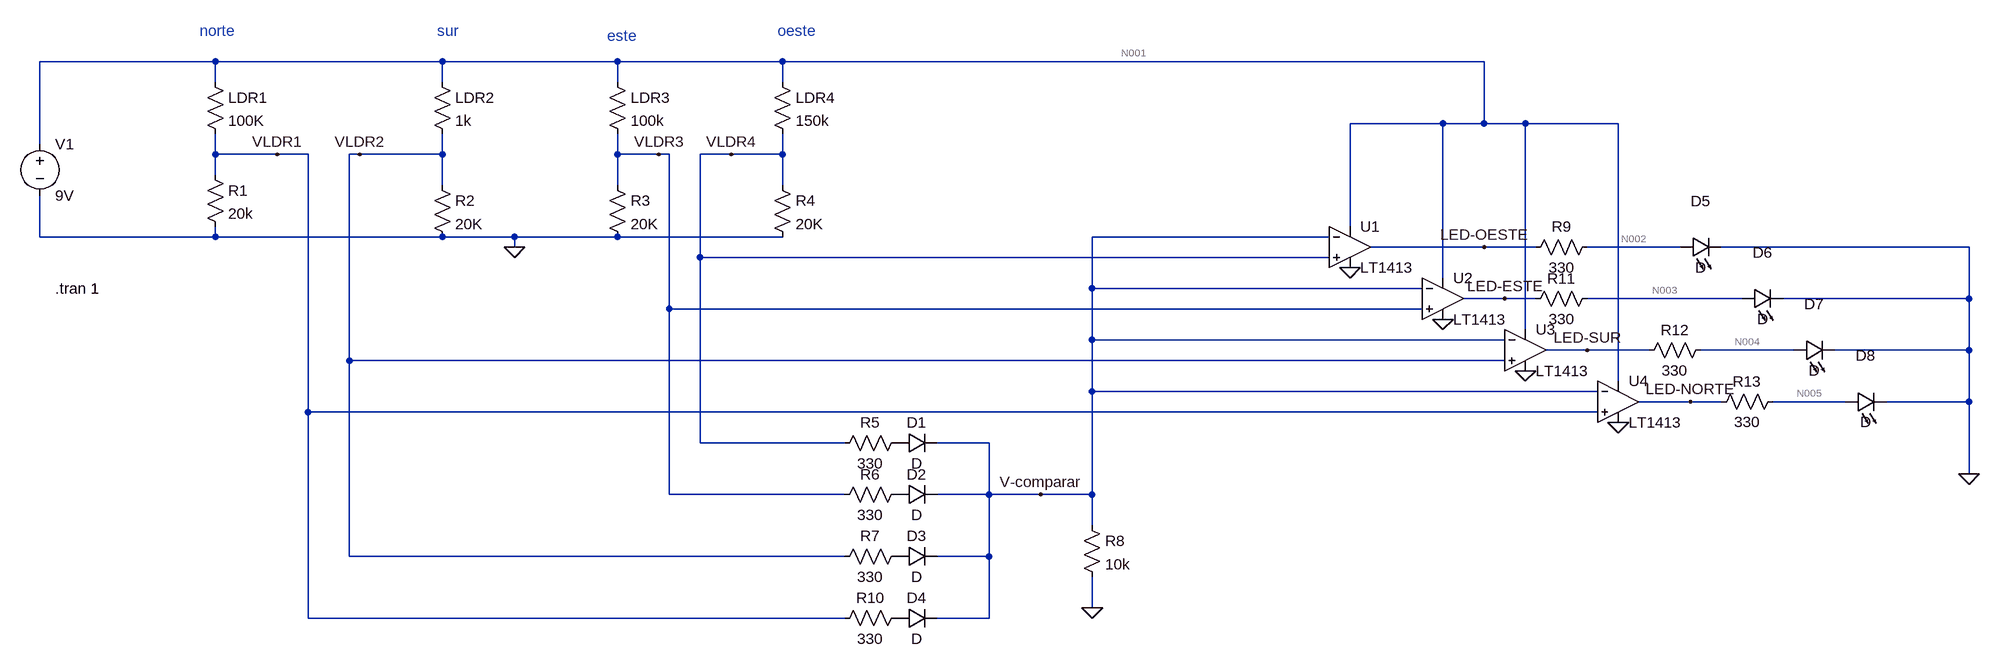
[diagram p0: schematic idea2_tp8.asc]
idea2_tp8.asc, the LTspice schematic file:
Version 4
SHEET 1 2996 704
WIRE 256 -592 -16 -592
WIRE 608 -592 256 -592
WIRE 880 -592 608 -592
WIRE 1136 -592 880 -592
WIRE 2224 -592 1136 -592
WIRE 256 -560 256 -592
WIRE 608 -560 608 -592
WIRE 880 -560 880 -592
WIRE 1136 -560 1136 -592
WIRE 2160 -496 2016 -496
WIRE 2224 -496 2224 -592
WIRE 2224 -496 2160 -496
WIRE 2288 -496 2224 -496
WIRE 2432 -496 2288 -496
WIRE -16 -464 -16 -592
WIRE 256 -448 256 -480
WIRE 352 -448 256 -448
WIRE 400 -448 352 -448
WIRE 480 -448 464 -448
WIRE 608 -448 608 -480
WIRE 608 -448 480 -448
WIRE 880 -448 880 -480
WIRE 944 -448 880 -448
WIRE 960 -448 944 -448
WIRE 1056 -448 1008 -448
WIRE 1136 -448 1136 -480
WIRE 1136 -448 1056 -448
WIRE 256 -416 256 -448
WIRE 608 -400 608 -448
WIRE 880 -400 880 -448
WIRE 1136 -400 1136 -448
WIRE 2016 -336 2016 -496
WIRE -16 -320 -16 -384
WIRE 256 -320 256 -336
WIRE 256 -320 -16 -320
WIRE 608 -320 256 -320
WIRE 720 -320 608 -320
WIRE 880 -320 720 -320
WIRE 1136 -320 880 -320
WIRE 1984 -320 1616 -320
WIRE 720 -304 720 -320
WIRE 2224 -304 2048 -304
WIRE 2304 -304 2224 -304
WIRE 2528 -304 2384 -304
WIRE 2976 -304 2592 -304
WIRE 1008 -288 1008 -448
WIRE 1984 -288 1008 -288
WIRE 2160 -256 2160 -496
WIRE 1616 -240 1616 -320
WIRE 2128 -240 1616 -240
WIRE 2256 -224 2192 -224
WIRE 2304 -224 2256 -224
WIRE 2624 -224 2384 -224
WIRE 2976 -224 2976 -304
WIRE 2976 -224 2688 -224
WIRE 960 -208 960 -448
WIRE 2128 -208 960 -208
WIRE 2288 -176 2288 -496
WIRE 1616 -160 1616 -240
WIRE 2256 -160 1616 -160
WIRE 2384 -144 2320 -144
WIRE 2480 -144 2384 -144
WIRE 2704 -144 2560 -144
WIRE 2976 -144 2976 -224
WIRE 2976 -144 2768 -144
WIRE 464 -128 464 -448
WIRE 2256 -128 464 -128
WIRE 2432 -96 2432 -496
WIRE 1616 -80 1616 -160
WIRE 2400 -80 1616 -80
WIRE 2544 -64 2464 -64
WIRE 2592 -64 2544 -64
WIRE 2784 -64 2672 -64
WIRE 2976 -64 2976 -144
WIRE 2976 -64 2848 -64
WIRE 400 -48 400 -448
WIRE 2400 -48 400 -48
WIRE 1008 0 1008 -288
WIRE 1232 0 1008 0
WIRE 1456 0 1376 0
WIRE 2976 48 2976 -64
WIRE 960 80 960 -208
WIRE 1232 80 960 80
WIRE 1456 80 1456 0
WIRE 1456 80 1376 80
WIRE 1536 80 1456 80
WIRE 1616 80 1616 -80
WIRE 1616 80 1536 80
WIRE 1616 128 1616 80
WIRE 464 176 464 -128
WIRE 1232 176 464 176
WIRE 1456 176 1456 80
WIRE 1456 176 1376 176
WIRE 1616 256 1616 208
WIRE 400 272 400 -48
WIRE 1232 272 400 272
WIRE 1456 272 1456 176
WIRE 1456 272 1376 272
FLAG 720 -304 0
FLAG 352 -448 VLDR1
FLAG 480 -448 VLDR2
FLAG 944 -448 VLDR3
FLAG 1056 -448 VLDR4
FLAG 1616 256 0
FLAG 2016 -272 0
FLAG 2160 -192 0
FLAG 2288 -112 0
FLAG 2432 -32 0
FLAG 2976 48 0
FLAG 2224 -304 LED-OESTE
FLAG 2256 -224 LED-ESTE
FLAG 2384 -144 LED-SUR
FLAG 2544 -64 LED-NORTE
FLAG 1536 80 V-comparar
SYMBOL voltage -16 -480 R0
WINDOW 123 0 0 Left 0
WINDOW 39 0 0 Left 0
SYMATTR InstName V1
SYMATTR Value 9V
SYMBOL res 240 -576 R0
SYMATTR InstName LDR1
SYMATTR Value 100K
SYMBOL res 240 -432 R0
SYMATTR InstName R1
SYMATTR Value 20k
SYMBOL res 592 -416 R0
SYMATTR InstName R2
SYMATTR Value 20K
SYMBOL res 592 -576 R0
SYMATTR InstName LDR2
SYMATTR Value 1k
SYMBOL res 864 -576 R0
SYMATTR InstName LDR3
SYMATTR Value 100k
SYMBOL res 864 -416 R0
SYMATTR InstName R3
SYMATTR Value 20K
SYMBOL res 1120 -416 R0
SYMATTR InstName R4
SYMATTR Value 20K
SYMBOL res 1120 -576 R0
SYMATTR InstName LDR4
SYMATTR Value 150k
SYMBOL res 1328 -16 R90
WINDOW 0 0 56 VBottom 2
WINDOW 3 32 56 VTop 2
SYMATTR InstName R5
SYMATTR Value 330
SYMBOL diode 1312 16 R270
WINDOW 0 32 32 VTop 2
WINDOW 3 0 32 VBottom 2
SYMATTR InstName D1
SYMBOL res 1328 64 R90
WINDOW 0 0 56 VBottom 2
WINDOW 3 32 56 VTop 2
SYMATTR InstName R6
SYMATTR Value 330
SYMBOL diode 1312 96 R270
WINDOW 0 32 32 VTop 2
WINDOW 3 0 32 VBottom 2
SYMATTR InstName D2
SYMBOL res 1328 160 R90
WINDOW 0 0 56 VBottom 2
WINDOW 3 32 56 VTop 2
SYMATTR InstName R7
SYMATTR Value 330
SYMBOL diode 1312 192 R270
WINDOW 0 32 32 VTop 2
WINDOW 3 0 32 VBottom 2
SYMATTR InstName D3
SYMBOL res 1328 256 R90
WINDOW 0 0 56 VBottom 2
WINDOW 3 32 56 VTop 2
SYMATTR InstName R10
SYMATTR Value 330
SYMBOL diode 1312 288 R270
WINDOW 0 32 32 VTop 2
WINDOW 3 0 32 VBottom 2
SYMATTR InstName D4
SYMBOL res 1600 112 R0
SYMATTR InstName R8
SYMATTR Value 10k
SYMBOL OpAmps\\LT1413 2016 -368 R0
SYMATTR InstName U1
SYMBOL OpAmps\\LT1413 2160 -288 R0
SYMATTR InstName U2
SYMBOL OpAmps\\LT1413 2288 -208 R0
SYMATTR InstName U3
SYMBOL OpAmps\\LT1413 2432 -128 R0
SYMATTR InstName U4
SYMBOL res 2400 -320 R90
WINDOW 0 0 56 VBottom 2
WINDOW 3 32 56 VTop 2
SYMATTR InstName R9
SYMATTR Value 330
SYMBOL res 2400 -240 R90
WINDOW 0 0 56 VBottom 2
WINDOW 3 32 56 VTop 2
SYMATTR InstName R11
SYMATTR Value 330
SYMBOL res 2576 -160 R90
WINDOW 0 0 56 VBottom 2
WINDOW 3 32 56 VTop 2
SYMATTR InstName R12
SYMATTR Value 330
SYMBOL res 2688 -80 R90
WINDOW 0 0 56 VBottom 2
WINDOW 3 32 56 VTop 2
SYMATTR InstName R13
SYMATTR Value 330
SYMBOL LED 2528 -288 R270
WINDOW 0 72 32 VTop 2
WINDOW 3 0 32 VBottom 2
SYMATTR InstName D5
SYMBOL LED 2624 -208 R270
WINDOW 0 72 32 VTop 2
WINDOW 3 0 32 VBottom 2
SYMATTR InstName D6
SYMBOL LED 2704 -128 R270
WINDOW 0 72 32 VTop 2
WINDOW 3 0 32 VBottom 2
SYMATTR InstName D7
SYMBOL LED 2784 -48 R270
WINDOW 0 72 32 VTop 2
WINDOW 3 0 32 VBottom 2
SYMATTR InstName D8
TEXT 8 -240 Left 2 !.tran 1
TEXT 232 -640 Left 2 ;norte
TEXT 600 -640 Left 2 ;sur
TEXT 864 -632 Left 2 ;este
TEXT 1128 -640 Left 2 ;oeste

The netlist it stands for:
* idea2_tp8.asc
V1 N001 0 9V
R§LDR1 N001 VLDR1 100K
R1 VLDR1 0 20k
R2 VLDR2 0 20K
R§LDR2 N001 VLDR2 1k
R§LDR3 N001 VLDR3 100k
R3 VLDR3 0 20K
R4 VLDR4 0 20K
R§LDR4 N001 VLDR4 150k
R5 P001 VLDR4 330
D1 P001 V-comparar D
R6 P002 VLDR3 330
D2 P002 V-comparar D
R7 P003 VLDR2 330
D3 P003 V-comparar D
R10 P004 VLDR1 330
D4 P004 V-comparar D
R8 V-comparar 0 10k
XU1 VLDR4 V-comparar N001 0 LED-OESTE LT1413  ; pins In+ In- V+ V- OUT
XU2 VLDR3 V-comparar N001 0 LED-ESTE LT1413  ; pins In+ In- V+ V- OUT
XU3 VLDR2 V-comparar N001 0 LED-SUR LT1413  ; pins In+ In- V+ V- OUT
XU4 VLDR1 V-comparar N001 0 LED-NORTE LT1413  ; pins In+ In- V+ V- OUT
R9 N002 LED-OESTE 330
R11 N003 LED-ESTE 330
R12 N004 LED-SUR 330
R13 N005 LED-NORTE 330
D5 N002 0 D
D6 N003 0 D
D7 N004 0 D
D8 N005 0 D
.model D D
.lib standard.dio
.tran 1
* norte
* sur
* este
* oeste
.lib LTC.lib
.backanno
.end

* Results of the author's LTspice run, read from the files saved beside the schematic
* Operating Point, zero values left out:
*   V(n001) = 9 V
*   V(vldr1) = 1.5 V
*   V(vldr2) = 7.902 V
*   V(vldr3) = 1.5 V
*   V(vldr4) = 1.059 V
*   V(p001) = 1.059 V
*   V(v-comparar) = 7.025 V
*   V(p002) = 1.5 V
*   V(p003) = 7.671 V
*   V(p004) = 1.5 V
*   V(led-oeste) = 64.42 mV
*   V(led-este) = 64.42 mV
*   V(led-sur) = 8.446 V
*   V(led-norte) = 64.42 mV
*   V(n002) = 64.42 mV
*   V(n003) = 64.42 mV
*   V(n004) = 736.6 mV
*   V(n005) = 64.42 mV
*   I(D1) = -5.975 pA
*   I(D2) = -5.534 pA
*   I(D3) = 702.5 µA
*   I(D4) = -5.534 pA
*   I(D7) = 23.36 mA
*   I(Ldr1) = 75 µA
*   I(R1) = 75.02 µA
*   I(R2) = 395.1 µA
*   I(Ldr2) = 1.098 mA
*   I(Ldr3) = 75 µA
*   I(R3) = 75.02 µA
*   I(R4) = 52.96 µA
*   I(Ldr4) = 52.94 µA
*   I(R5) = 5.975 pA
*   I(R6) = 5.534 pA
*   I(R7) = -702.5 µA
*   I(R10) = 5.534 pA
*   I(R8) = 702.5 µA
*   I(R12) = -23.36 mA
*   I(V1) = -25.63 mA